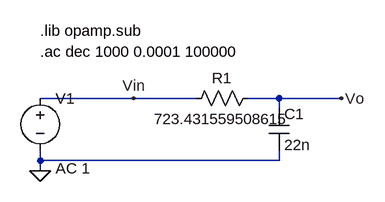
[diagram p0: schematic lpf.asc]
lpf.asc, the LTspice schematic file:
Version 4
SHEET 1 880 680
WIRE -208 208 -352 208
WIRE -112 208 -208 208
WIRE 16 208 -32 208
WIRE 112 208 16 208
WIRE 16 224 16 208
WIRE -352 304 -352 288
WIRE 16 304 16 288
WIRE 16 304 -352 304
WIRE -352 320 -352 304
FLAG 112 208 Vo
FLAG -208 208 Vin
FLAG -352 320 0
SYMBOL voltage -352 192 R0
WINDOW 123 24 124 Left 2
WINDOW 39 0 0 Left 0
SYMATTR Value2 AC 1
SYMATTR InstName V1
SYMATTR Value ""
SYMBOL res -16 192 R90
WINDOW 0 0 56 VBottom 2
WINDOW 3 32 56 VTop 2
SYMATTR InstName R1
SYMATTR Value 723.431559508615
SYMBOL cap 0 224 R0
SYMATTR InstName C1
SYMATTR Value 22n
TEXT -352 104 Left 2 !.lib opamp.sub
TEXT -352 136 Left 2 !.ac dec 1000 0.0001 100000

The netlist it stands for:
* lpf.asc
V1 Vin 0 AC 1
R1 Vo Vin 723.431559508615
C1 Vo 0 22n
.lib opamp.sub
.ac dec 1000 0.0001 100000
.backanno
.end